# Altium schematic sheet Power.SchDoc
size A4; CompanyName: Technische Hochschule Nürnberg Georg Simon Ohm; Organization: UltraZohm; Address1: Kesslerplatz 12; Address2: 90489 Nürnberg; Address3: GERMANY; Website: www.ultrazohm.com
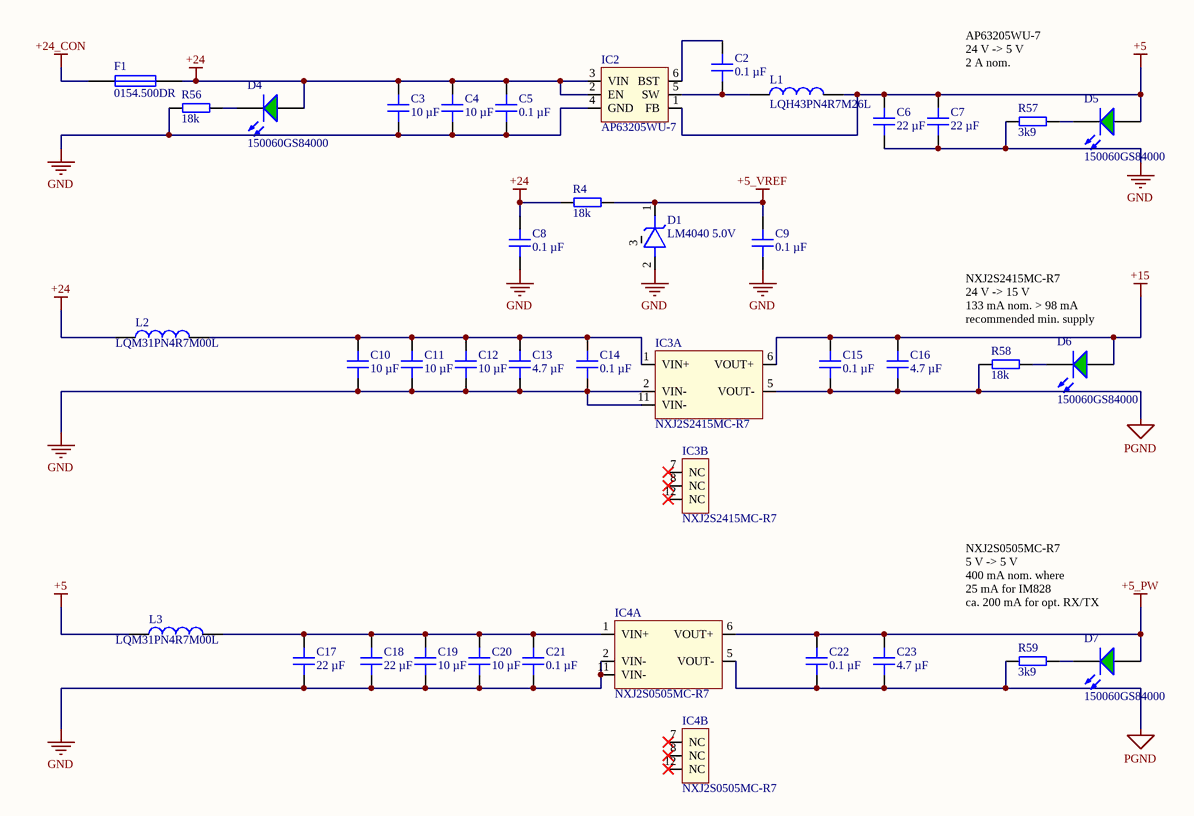
[diagram p0: Power.SchDoc]

## Parts
C2  0.1 µF  [C_0603]
C3  10 µF  [C_1206]
C4  10 µF  [C_1206]
C5  0.1 µF  [C_0603]
C6  22 µF  [C_1206]
C7  22 µF  [C_1206]
C8  0.1 µF  [C_0603]
C9  0.1 µF  [C_0603]
C10  10 µF  [C_1206]
C11  10 µF  [C_1206]
C12  10 µF  [C_1206]
C13  4.7 µF  [C_0805]
C14  0.1 µF  [C_0603]
C15  0.1 µF  [C_0603]
C16  4.7 µF  [C_0805]
C17  22 µF  [C_1206]
C18  22 µF  [C_1206]
C19  10 µF  [C_1206]
C20  10 µF  [C_1206]
C21  0.1 µF  [C_0603]
C22  0.1 µF  [C_0603]
C23  4.7 µF  [C_0805]
D1  LM4040 5.0V  [SOT-23-3]
D4  150060GS84000  [WL-SMCW_0603]
D5  150060GS84000  [WL-SMCW_0603]
D6  150060GS84000  [WL-SMCW_0603]
D7  150060GS84000  [WL-SMCW_0603]
F1  0154.500DR  [Littlefuse_154]
IC2  AP63205WU-7  [TSOT26-6]
IC3  NXJ2S2415MC-R7  [DCDC]  (parts A,B of 2)
IC4  NXJ2S0505MC-R7  [DCDC]  (parts A,B of 2)
L1  LQH43PN4R7M26L  [IND]
L2  LQM31PN4R7M00L  [IND 1206_3216]
L3  LQM31PN4R7M00L  [IND 1206_3216]
R4  18k  [RES 0603_1608]
R56  18k  [RES 0603_1608]
R57  3k9  [RES 0603_1608]
R58  18k  [RES 0603_1608]
R59  3k9  [RES 0603_1608]

## Nets
+5: C6.2 C7.2 D5.2(A) IC2.1(FB) L1.2 L3.1
+5_PW: C22.2 C23.2 D7.2(A) IC4.6(VOUT+)
+5_VREF: C9.2 D1.1(K) R4.2
+15: C15.2 C16.2 D6.2(A) IC3.6(VOUT+)
+24: C3.2 C4.2 C5.2 C8.2 D4.2(A) F1.2 IC2.2(EN) IC2.3(VIN) L2.1 R4.1
+24_CON: F1.1
GND: C3.1 C4.1 C5.1 C6.1 C7.1 C8.1 C9.1 C10.1 C11.1 C12.1 C13.1 C14.1 C17.1 C18.1 C19.1 C20.1 C21.1 D1.2(A) IC2.4(GND) IC3.2(VIN-) IC3.11(VIN-) IC4.2(VIN-) IC4.11(VIN-) R56.1 R57.1
PGND: C15.1 C16.1 C22.1 C23.1 IC3.5(VOUT-) IC4.5(VOUT-) R58.1 R59.1
NetC2_1: C2.1 IC2.5(SW) L1.1
NetC2_2: C2.2 IC2.6(BST)
NetC10_2: C10.2 C11.2 C12.2 C13.2 C14.2 IC3.1(VIN+) L2.2
NetC17_2: C17.2 C18.2 C19.2 C20.2 C21.2 IC4.1(VIN+) L3.2
NetD4_1: D4.1(K) R56.2
NetD5_1: D5.1(K) R57.2
NetD6_1: D6.1(K) R58.2
NetD7_1: D7.1(K) R59.2

Not connected (* = marked no-connect by the designer): D1 3(NC); IC3 7(NC)* 8(NC)* 12(NC)*; IC4 7(NC)* 8(NC)* 12(NC)*

## Notes on the sheet
- AP63205WU-7
  24 V -> 5 V
  2 A nom.
- NXJ2S2415MC-R7
  24 V -> 15 V
  133 mA nom. > 98 mA
  recommended min. supply
- NXJ2S0505MC-R7
  5 V -> 5 V
  400 mA nom. where
  25 mA for IM828
  ca. 200 mA for opt. RX/TX
- Title
- Revision:
- Design Engineer:
- Date:
- Project:
- Sheet
- of

## Library data of the parts
C2 C5 C8 C9 C14 C15 C21 C22 = C0603X104K5RAC7411: Capacitor 0603, 50 VDC, 0.1 µF, X7R; Manufacturer: KEMET; Tolerance: 10 %; Voltage Rating: 50 VDC; Created from: MGremer; Manufacturer Part Number: C0603X104K5RAC7411; PartID: 3; Created On: 20.12.2020 13:54:13; ComponentLink1Description: Datasheet; ComponentLink1URL: https://www.mouser.de/datasheet/2/212/1/KEM_C1013_X7R_FT_CAP_SMD-1103280.pdf; Component Type: Capacitor 0603; Device Package: 0603; Last Updated: 04.03.2021 09:24:28; Mounting Type: SMD; Operating Temperature: -55 - 125°C; Series: SMD Comm X7R Flex; Supplier 1: Mouser; Supplier Part Number 1: 80-C0603X104K5R7411; Supplier 2: LCSC; Supplier Part Number 2: C14663; Type: Capacitor; Value: 0.1 µF; Live Cycle Status: 1; LCSC Part Number: C14663; Stock number: Labor SMD Container
C3 C4 C10-C12 C19 C20 = CGA5L1X7R1H106K160AC: Capacitor 1206, 50 VDC, 10 µF, X7R; Manufacturer: TDK; Tolerance: 10 %; Voltage Rating: 50 VDC; Created from: MGremer; Manufacturer Part Number: CGA5L1X7R1H106K160AC; PartID: 25; Created On: 20.12.2020 13:54:13; ComponentLink1Description: Datasheet; ComponentLink1URL: https://product.tdk.com/info/en/catalog/datasheets/mlcc_automotive_general_en.pdf; Component Type: Capacitor 1206; Device Package: 1206; Last Updated: 27.05.2022 14:15:21; Mounting Type: SMD; Operating Temperature: -55 - 125°C; Series: CGA; Supplier 1: Mouser; Supplier Part Number 1: 810-CGA5L1X7R1H106K1; Type: Capacitor; Value: 10 µF; Live Cycle Status: 1; LCSC Part Number: C13585; Stock number: Labor SMD Container
C6 C7 C17 C18 = C3216X5R1V226M160AC: Capacitor 1206, 35 VDC, 22µF, X5R; Manufacturer: TDK; Tolerance: 20 %; Voltage Rating: 35 VDC; Created from: VStarost; Manufacturer Part Number: C3216X5R1V226M160AC; PartID: 116; Created On: 14.12.2022 12:32:58; ComponentLink1Description: Datasheet; ComponentLink1URL: https://product.tdk.com/system/files/dam/doc/product/capacitor/ceramic/mlcc/catalog/mlcc_commercial_general_en.pdf; Component Type: Capacitor 1206; Device Package: 1206; Last Updated: 14.12.2022 12:38:27; Mounting Type: SMD; Operating Temperature: -55 - 85°C; Series: C; Supplier 1: Mouser; Supplier Part Number 1: 810-C3216X5R1V226M; Type: Capacitor; Value: 22 µF; Live Cycle Status: 1; Stock number: KA126
C13 C16 C23 = C2012X7R1H475K125AC: Capacitor 0805, 50 VDC, 4.7 µF, X7R; Manufacturer: TDK; Tolerance: 10 %; Voltage Rating: 50 VDC; Created from: MGremer; Manufacturer Part Number: C2012X7R1H475K125AC; PartID: 15; Created On: 20.12.2020 13:54:13; ComponentLink1Description: Datasheet; ComponentLink1URL: https://product.tdk.com/info/en/catalog/datasheets/mlcc_commercial_general_en.pdf; Component Type: Capacitor 0805; Device Package: 0805; Last Updated: 20.12.2020 16:34:30; Mounting Type: SMD; Operating Temperature: -55 - 125°C; Series: C; Supplier 1: Mouser; Supplier Part Number 1: 810-C2012X7R475K125C; Type: Capacitor; Value: 4.7 µF; Live Cycle Status: 1; Stock number: Labor SMD Container
D1 = LM4040CIM3-5.0+T: Voltage Reference, 5.0V, ±0.5%, ±15mA; Manufacturer: Analog Devices; Created from: VStarost; Manufacturer Part Number: LM4040CIM3-5.0+T; PartID: 13; Created On: 02.02.2023 11:02:52; ComponentLink1Description: Datasheet; ComponentLink1URL: https://www.mouser.de/datasheet/2/256/LM4040-LM4040D-962257.pdf; Component Type: Voltage Reference; Device Package: SMD; Last Updated: 02.02.2023 11:02:52; Mounting Type: SMD; Operating Temperature: -40 - 85 °C; Series: LM4040C; Supplier 1: Mouser; Supplier Part Number 1: 700-LM4040CIM3-5.0T; Type: Voltage Reference; Value: LM4040 5.0V; Live Cycle Status: 1; Stock number: not stored
D4-D7 = 150060GS84000: WL-SMCW SMD Mono-color Chip LED Waterclear Green; Manufacturer: Wuerth Elektronik; Type: Standard; Created from: MGremer; Forward Current I_f: 20 mA; Forward Voltage U_f: 3.2 V; Wavelength: 525 nm; Light Intensity: 3000 mcd; Nominal Power: 78 mW; Manufacturer Part Number: 150060GS84000; PartID: 2; Created On: 08.12.2020 10:41:11; ComponentLink1Description: Datasheet; ComponentLink1URL: https://www.mouser.de/datasheet/2/445/150060GS75020-1714345.pdf; Component Type: LED Diode; Device Package: 0603; Last Updated: 03.03.2021 09:59:51; Mounting Type: SMD; Operating Temperature: -40 - 85 °C; Supplier 1: Mouser; Supplier Part Number 1: 710-150060GS84000; Supplier 2: Farnell; Supplier Part Number 2: 3408612; Supplier 3: Digi-Key; Supplier Part Number 3: 732-150060GS84000CT-ND; Live Cycle Status: 1; Stock number: not stored; Color: green
F1 = 0154.500DR: Fuse OMNI BLOK 154; Manufacturer: Littlefuse; Nominal current: 500 mA; Nominal voltage AC: 125 VAC; Nominal voltage DC: 125 VDC; Resistance: 304.6 mOhm; Value: 500 mA; Created from: MGremer; Manufacturer Part Number: 0154.500DR; PartID: 2; Created On: 07.01.2021 10:17:19; ComponentLink1Description: Datasheet; ComponentLink1URL: https://www.mouser.de/datasheet/2/240/Littelfuse_Fuse_154_154T_154L_154TL_Datasheet_pdf-365375.pdf; Component Type: NAN02 - 154 OMNI-BLOK; Device Package: OMNI-BLOK; Last Updated: 07.01.2021 10:22:49; Mounting Type: SMD; Operating Temperature: -55 - 125 °C; Series: 154; Supplier 1: Mouser; Supplier Part Number 1: 576-0154.500DR; Type: Fuse; Live Cycle Status: 1
IC2 = AP63205WU-7: Switching Voltage Regulators DCDC Conv HV Buck TSOT26 T&R 3K; Manufacturer: Diodes Incorporate; Created from: VStarost; Manufacturer Part Number: AP63205WU-7; PartID: 2; Created On: 13.12.2022 12:26:50; ComponentLink1Description: Datasheet; ComponentLink1URL: https://www.mouser.de/datasheet/2/115/DIOD_S_A0007089856_1-2542907.pdf; Component Type: Buck Converter; Last Updated: 13.12.2022 12:26:50; Mounting Type: SMD; Operating Temperature: -40 - 85 °C; Supplier 1: Mouser; Supplier Part Number 1: 621-AP63205WU-7; Type: Switching Regulator; Live Cycle Status: 1; Stock number: not stored
IC3 = NXJ2S2415MC-R7: Isolated DC/DC Converters - SMD 21.6V TO 26.4V IN 15V OUT; Manufacturer: Murata; Value: 2 W; Created from: VStarost; Manufacturer Part Number: NXJ2S2415MC-R7; PartID: 25; Created On: 13.12.2022 13:30:59; ComponentLink1Description: Datasheet; ComponentLink1URL: https://www.mouser.de/datasheet/2/281/1/kdc_nxj2-2941192.pdf; Component Type: DC-DC Converter; Device Package: -; Last Updated: 13.12.2022 13:30:59; Mounting Type: SMD; Operating Temperature: -40 - 85 °C; Series: NXJ2; Supplier 1: Mouser; Supplier Part Number 1: 580-NXJ2S2415MC-R7; Type: isolated DC-DC Converter; Live Cycle Status: 1; Stock number: not stored
IC4 = NXJ2S0505MC-R7: Isolated DC/DC Converters - SMD 4.5V TO 5.5V IN 5V OUT; Manufacturer: Murata; Value: 2 W; Created from: VStarost; Manufacturer Part Number: NXJ2S0505MC-R7; PartID: 26; Created On: 21.12.2022 14:43:56; ComponentLink1Description: Datasheet; ComponentLink1URL: https://www.murata.com/products/productdata/8807031996446/kdc-nxj2.pdf; Component Type: DC-DC Converter; Device Package: -; Last Updated: 21.12.2022 14:43:56; Mounting Type: SMD; Series: NXJ2; Supplier 1: Digi-Key; Supplier Part Number 1: 811-3818-1-ND; Type: isolated DC-DC Converter; Live Cycle Status: 1; Stock number: not stored
L1 = LQH43PN4R7M26L: Leistungsinduktivitäten – SMD 4.7 UH 20%; Manufacturer: Murata; MF: EPCOS / TDK; Value: 4.7 uH; DCR: 320m; Rated Current: 0.85 A; Type: Inductance SMD; DC current: 1.4 A; Created from: VStarost; MPN: B82464G4154M; Supplier 1: Mouser; Supplier Part Number 1: 81-LQH43PN4R7M26L; Manufacturer Part Number: LQH43PN4R7M26L; PartID: 15; Created On: 31.01.2023 09:01:23; ComponentLink1Description: Datasheet; ComponentLink1URL: https://www.mouser.de/datasheet/2/281/JELF243A_0093-1517796.pdf; Component Type: Inductance; Device Package: 1812; Last Updated: 31.01.2023 09:02:10; Mounting Type: SMD; Operating Temperature: -40 - 85 °C; Series: LQH; Live Cycle Status: 1; Stock number: not stored
L2 L3 = LQM31PN4R7M00L: Power Inductors - SMD 4.7 UH 20%; Manufacturer: Murata; MF: EPCOS / TDK; Value: 4.7 uH; DCR: 320m; Rated Current: 0.85 A; Type: Inductance SMD; DC current: 700 mA; Created from: VStarost; MPN: B82464G4154M; Supplier 1: Mouser; Supplier Part Number 1: 81-LQM31PN4R7M00L; Manufacturer Part Number: LQM31PN4R7M00L; PartID: 14; Created On: 21.12.2022 14:39:27; ComponentLink1Description: Datasheet; ComponentLink1URL: https://www.mouser.de/datasheet/2/281/1/JELF243B_0013-1634236.pdf; Component Type: Inductance; Device Package: 1206; Last Updated: 15.02.2023 18:04:47; Mounting Type: SMD; Operating Temperature: -55 - 125 °C; Series: LQM; Live Cycle Status: 1; Stock number: not stored; LCSC Part Number: C162588
R4 R56 R58 = RK73B1JTTD183J: SMD resistor E24 series; Manufacturer: KOA Speer; Tolerance: 5%; Created from: MGremer; Manufacturer Part Number: RK73B1JTTD183J; PartID: 104; Created On: 14.12.2020 16:17:14; ComponentLink1Description: Datasheet; ComponentLink1URL: https://www.mouser.de/datasheet/2/219/RK73B-1825463.pdf; Component Type: SMD resistor; Device Package: 0603; Last Updated: 15.02.2023 17:57:37; Mounting Type: SMD; Supplier 1: Mouser; Supplier Part Number 1: 660-RK73B1JTTD183J; Type: Resistor; Value: 18k; Live Cycle Status: 1; Stock number: Labor SMD Container; LCSC Part Number: C177285
R57 R59 = RK73B1JTTDD392J: SMD resistor E24 series; Manufacturer: KOA Speer; Tolerance: 5%; Created from: MGremer; Manufacturer Part Number: RK73B1JTTDD392J; PartID: 88; Created On: 14.12.2020 16:17:14; ComponentLink1Description: Datasheet; ComponentLink1URL: https://www.mouser.de/datasheet/2/219/RK73B-1825463.pdf; Component Type: SMD resistor; Device Package: 0603; Last Updated: 15.02.2023 17:47:58; Mounting Type: SMD; Supplier 1: Mouser; Supplier Part Number 1: 660-RK73B1JTTDD392J; Type: Resistor; Value: 3k9; Live Cycle Status: 1; Stock number: Labor SMD Container; LCSC Part Number: C177310